# EAGLE board Logic_board (EAGLE 7.6.0)
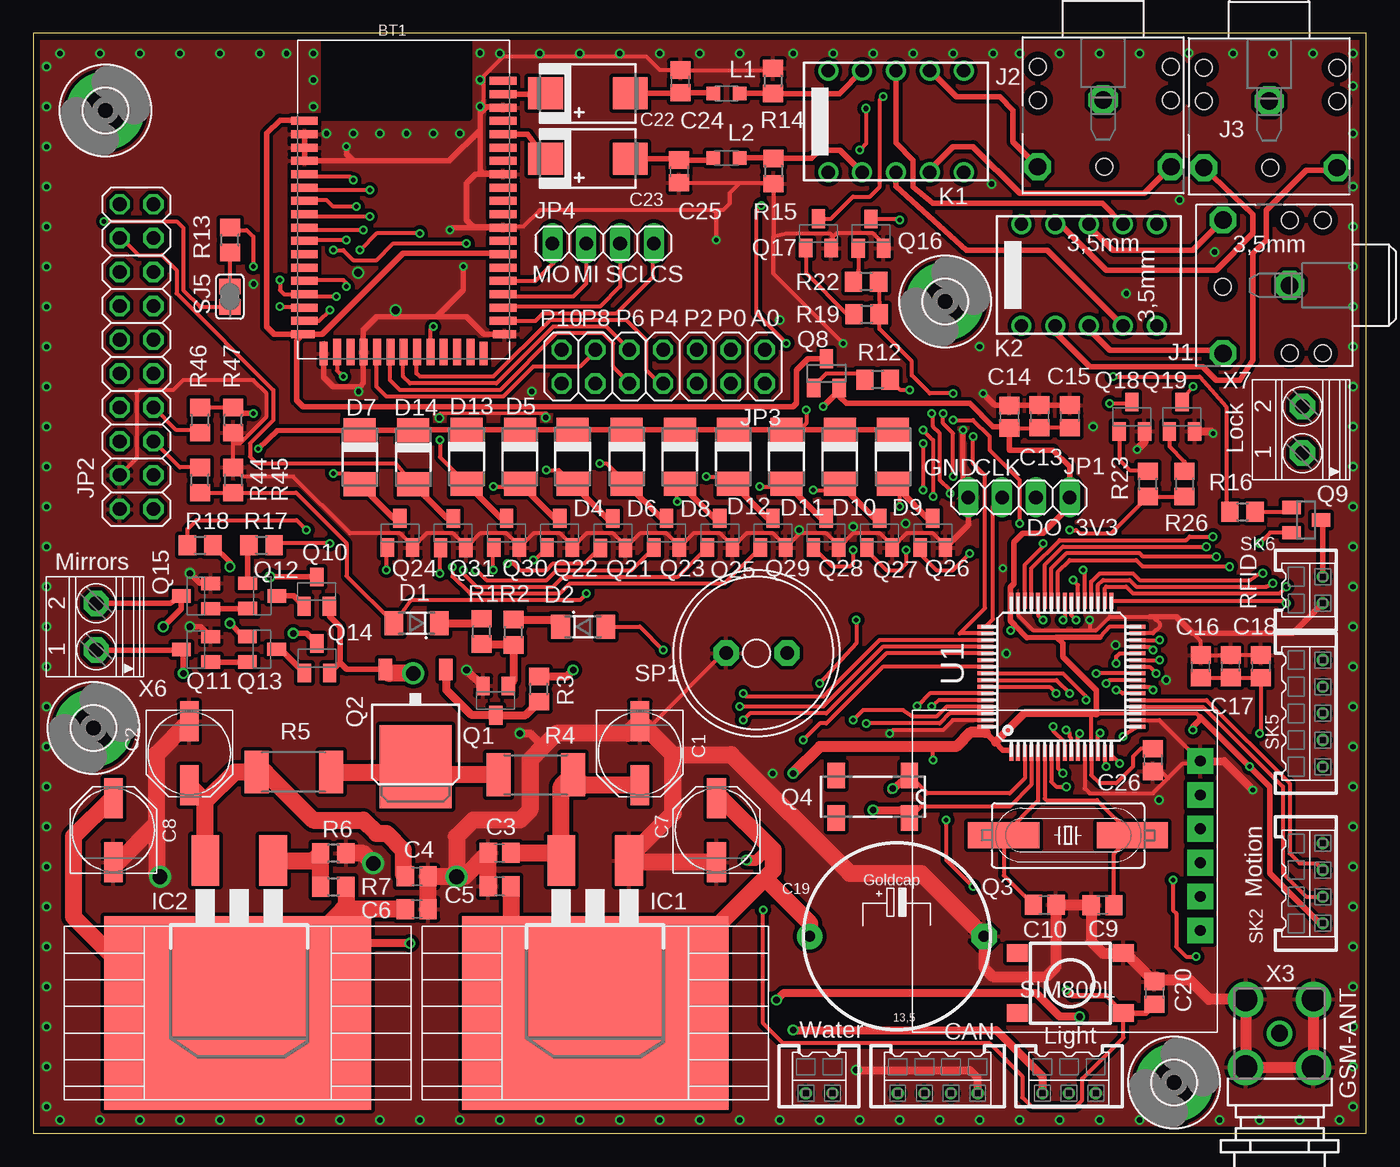
[diagram p1: board, top side]
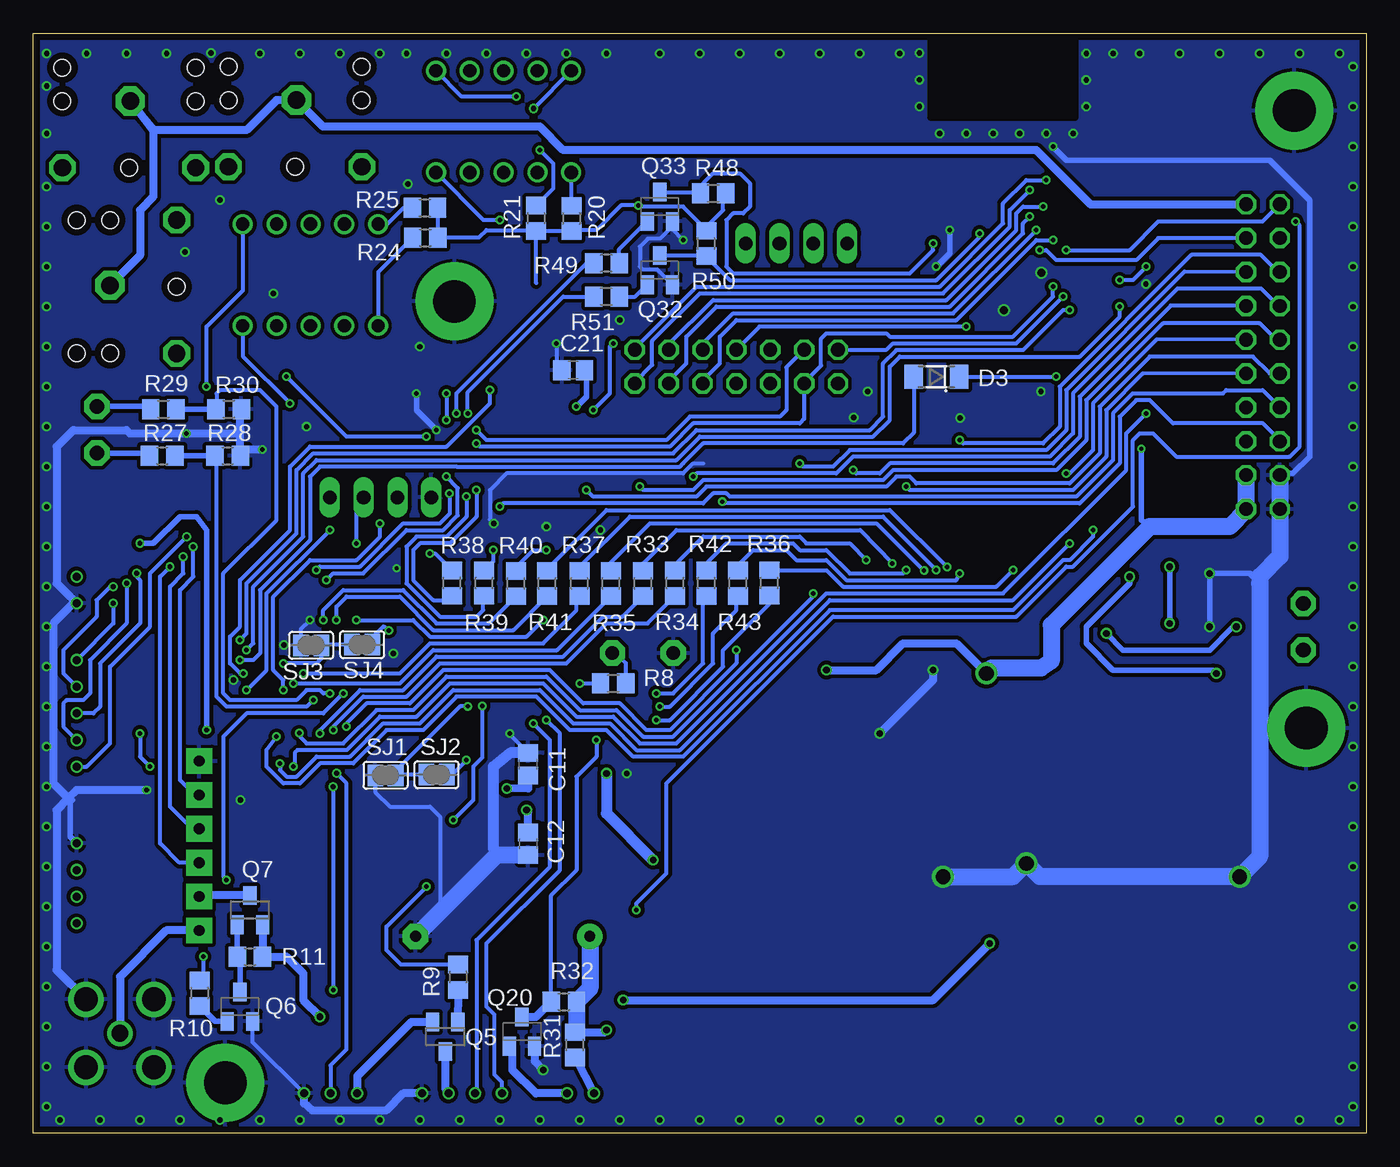
[diagram p2: board, bottom side, seen from below]

Size 100 x 82.5 mm. Coordinates in mm from the lower left corner, seen from the top.
Outline: 0,0 100,0 100,82.5 0,82.5 0,0
Copper layers (1*16): Top 0.035mm / dielectric 1.6mm / Bottom 0.035mm
Design rules "Elecrow_2-layer_PCB_eagle_rule": minimum track width 6mil, minimum drill 12mil, track to track 6mil, track to pad 6mil, pad to pad 6mil, via to via 8mil, smd to smd 0mil, copper to edge 20mil, drill to drill 10mil, minimum pad ring 6mil, minimum via ring 6mil, stop-mask expansion 0mil, vias tented up to drill 100mil, thermal gap 10mil

## Footprints (pad centres in the part's own frame; a part is rotated, then mirrored left to right if it is on the bottom)
WT32I = smd 2 x 0.6: 1 0.5,17.83; 2 0.5,16.83; 3 0.5,15.83; 4 0.5,14.83; 5 0.5,13.83; 6 0.5,12.83; 7 0.5,11.83; 8 0.5,10.83; 9 0.5,9.83; 10 0.5,8.83; 11 0.5,7.83; 12 0.5,6.83; 13 0.5,5.83; 14 0.5,4.83; 15 0.5,3.83; 16 0.5,2.83; 32 15.4,2.83; 33 15.4,3.83; 34 15.4,4.83; 35 15.4,5.83; 36 15.4,6.83; 37 15.4,7.83; 38 15.4,8.83; 39 15.4,9.83; 40 15.4,10.83; 41 15.4,11.83; 42 15.4,12.83; 43 15.4,13.83; 44 15.4,14.83; 45 15.4,15.83; 46 15.4,16.83; 47 15.4,17.83; 48 15.4,18.83; 49 15.4,19.83; 50 15.4,20.83 | smd 1.75 x 0.6: 17 0.38,1.83; 31 15.52,1.83 | smd 0.6 x 1.75: 18 1.95,0.38; 30 13.95,0.38 | smd 0.6 x 2: 19 2.95,0.5; 20 3.95,0.5; 21 4.95,0.5; 22 5.95,0.5; 23 6.95,0.5; 24 7.95,0.5; 25 8.95,0.5; 26 9.95,0.5; 27 10.95,0.5; 28 11.95,0.5; 29 12.95,0.5
PANASONIC_D = smd 3 x 1.4: + 2.4,0; - -2.4,0
C2012 = smd 1.3 x 1.5: 1 -0.85,0; 2 0.85,0
PAC-G-1 = drill 0.813 pad 1.93: + -6.54,0 | drill 0.813 pad 1.93 octagon: - 6.54,0
7343/T = smd 2.6 x 2.4: + 3.175,0; - -3.175,0
SOD80_DO213AA_MINIMELF = smd 1.4 x 1.8: A 1.7,0; C -1.7,0
DO-214AC = smd 1.8 x 2.4: A 2.025,0; C -2.025,0
D2PACK_HEATSINK = smd 20 x 14.5: 1 0,0
D2PACK = smd 2.083 x 3.81: 1 -2.54,-8.89; 3 2.54,-8.89 | smd 11.43 x 8.89: 2 0,2.54
STX3100 = drill 1.3 pad 2.184 octagon: 1 4.5,-0.1 | drill 1.3 pad 2 octagon: 2 9.5,5; 3 9.5,-5 | hole 1.25: 9.5,0; 4.5,5; 4.5,-5; 2,-5; 2,5
1X04 = drill 1.016 long: 1 -3.81,0; 2 -1.27,0; 3 1.27,0; 4 3.81,0
2X10 = drill 1.016 octagon: 1 -11.43,-1.27; 2 -11.43,1.27; 3 -8.89,-1.27; 4 -8.89,1.27; 5 -6.35,-1.27; 6 -6.35,1.27; 7 -3.81,-1.27; 8 -3.81,1.27; 9 -1.27,-1.27; 10 -1.27,1.27; 11 1.27,-1.27; 12 1.27,1.27; 13 3.81,-1.27; 14 3.81,1.27; 15 6.35,-1.27; 16 6.35,1.27; 17 8.89,-1.27; 18 8.89,1.27; 19 11.43,-1.27; 20 11.43,1.27
2X07 = drill 1.016 octagon: 1 -7.62,-1.27; 2 -7.62,1.27; 3 -5.08,-1.27; 4 -5.08,1.27; 5 -2.54,-1.27; 6 -2.54,1.27; 7 0,-1.27; 8 0,1.27; 9 2.54,-1.27; 10 2.54,1.27; 11 5.08,-1.27; 12 5.08,1.27; 13 7.62,-1.27; 14 7.62,1.27
TF2 = drill 1: 1 -5.08,-3.81; 2 -2.54,-3.81; 3 0,-3.81; 4 2.54,-3.81; 5 5.08,-3.81; 6 5.08,3.81; 7 2.54,3.81; 8 0,3.81; 9 -2.54,3.81; 10 -5.08,3.81
L2012C = smd 1 x 1: 1 -1,0; 2 1,0
SOT23-BEC = smd 1 x 1.4: B -0.95,-1.1; C 0,1.1; E 0.95,-1.1
D-PAK_TO252AA = smd 1 x 1.6: 1 -2.28,-4.8; 3 2.28,-4.8 | smd 5.4 x 6.2: 4 0,2.5
HC49UP = smd 5.334 x 1.93: 1 -4.826,0; 2 4.826,0
MC-306 = smd 1.3 x 1.9: 1 -2.75,-1.6; 2 2.75,-1.6; 3 2.75,1.6; 4 -2.75,1.6
SOT23 = smd 1 x 1.4: 1 -0.95,-1.1; 2 0.95,-1.1; 3 0,1.1
R0805 = smd 1.3 x 1.5: 1 -0.95,0; 2 0.95,0
R2512 = smd 1.8 x 3.2: 1 -2.8,0; 2 2.8,0
TACTILE_SWITCH_TALL = smd 1.55 x 1.3: A1 -3.975,-2.25; A2 3.975,-2.25; B1 -3.975,2.25; B2 3.975,2.25
SJ = smd 1.168 x 1.6: 1 -0.762,0; 2 0.762,0
DF3S-04 = drill 0.6: 1 -3,-1; 2 -1,-1; 3 1,-1; 4 3,-1
DF3S-03 = drill 0.6: 1 -2,-1; 2 0,-1; 3 2,-1
DF3S-02 = drill 0.6: 1 -1,-1; 2 1,-1
DF3S-05 = drill 0.6: 1 -4,-1; 2 -2,-1; 3 0,-1; 4 2,-1; 5 4,-1
AL11P = drill 1.016 pad 1.905 octagon: + 2.286,0; - -2.286,0
TQFP64 = smd 1.2 x 0.3: 1 -5.7,3.75; 2 -5.7,3.25; 3 -5.7,2.75; 4 -5.7,2.25; 5 -5.7,1.75; 6 -5.7,1.25; 7 -5.7,0.75; 8 -5.7,0.25; 9 -5.7,-0.25; 10 -5.7,-0.75; 11 -5.7,-1.25; 12 -5.7,-1.75; 13 -5.7,-2.25; 14 -5.7,-2.75; 15 -5.7,-3.25; 16 -5.7,-3.75; 33 5.7,-3.75; 34 5.7,-3.25; 35 5.7,-2.75; 36 5.7,-2.25; 37 5.7,-1.75; 38 5.7,-1.25; 39 5.7,-0.75; 40 5.7,-0.25; 41 5.7,0.25; 42 5.7,0.75; 43 5.7,1.25; 44 5.7,1.75; 45 5.7,2.25; 46 5.7,2.75; 47 5.7,3.25; 48 5.7,3.75 | smd 0.3 x 1.2: 17 -3.75,-5.7; 18 -3.25,-5.7; 19 -2.75,-5.7; 20 -2.25,-5.7; 21 -1.75,-5.7; 22 -1.25,-5.7; 23 -0.75,-5.7; 24 -0.25,-5.7; 25 0.25,-5.7; 26 0.75,-5.7; 27 1.25,-5.7; 28 1.75,-5.7; 29 2.25,-5.7; 30 2.75,-5.7; 31 3.25,-5.7; 32 3.75,-5.7; 49 3.75,5.7; 50 3.25,5.7; 51 2.75,5.7; 52 2.25,5.7; 53 1.75,5.7; 54 1.25,5.7; 55 0.75,5.7; 56 0.25,5.7; 57 -0.25,5.7; 58 -0.75,5.7; 59 -1.25,5.7; 60 -1.75,5.7; 61 -2.25,5.7; 62 -2.75,5.7; 63 -3.25,5.7; 64 -3.75,5.7
SIM-CORE = drill 0.8 pad 1.93 square: GND 1.27,3.81; NET 1.27,16.51; RST 1.27,11.43; RXD 1.27,8.89; TXD 1.27,6.35; VCC 1.27,13.97
3,2-PAD = drill 3.2 pad 5.842: B3,2 0,0
BU-SMA-G = drill 1.27: 1 0,0 | drill 1.778: 2 -2.55,2.55; 3 2.55,2.55; 4 2.55,-2.55; 5 -2.55,-2.55
1751248 = drill 1.1 pad 1.905 octagon: 1 -1.75,-0.1; 2 1.75,-0.1

## Placement (x,y rotation side)
BT1  WT32I  [WT32I]  19.84,58.1 0 top
C1  220uF  [PANASONIC_D]  45.5,28.5 270 top
C2  220uF  [PANASONIC_D]  11.7,28.5 270 top
C3  100n  [C2012]  34.98,21.03 180 top
C4  100n  [C2012]  28.77,19.27 0 top
C5  100n  [C2012]  34.98,18.53 180 top
C6  100n  [C2012]  28.77,16.82 0 top
C7  220uF  [PANASONIC_D]  51.25,22.75 90 top
C8  220uF  [PANASONIC_D]  6,22.75 90 top
C9  10pF  [C2012]  80.22,17.12 0 top
C10  10pF  [C2012]  75.88,17.13 180 top
C11  6,8pF  [C2012]  62.88,27.68 270 bottom
C12  6,8pF  [C2012]  62.87,21.72 90 bottom
C13  100nF  [C2012]  75.5,53.76 270 top
C14  100nF  [C2012]  73.23,53.74 270 top
C15  100nF  [C2012]  77.77,53.77 270 top
C16  100nF  [C2012]  87.58,35.01 270 top
C17  100nF  [C2012]  89.83,35.03 270 top
C18  100nF  [C2012]  92.11,35.02 270 top
C19  [PAC-G-1]  64.79,14.77 0 top
C20  100nF  [C2012]  84.12,10.53 270 top
C21  2u2  [C2012]  59.5,57.25 180 bottom
C22  330u/6V3  [7343/T]  41.6,78 180 top
C23  330u/6V3  [7343/T]  41.6,73.1 180 top
C24  33p  [C2012]  48.55,78.89 270 top
C25  33p  [C2012]  48.45,72.14 270 top
C26  100nF  [C2012]  84,28 90 top
D1  LL4148  [SOD80_DO213AA_MINIMELF]  28.75,38.25 180 top
D2  LL4148  [SOD80_DO213AA_MINIMELF]  41.25,38 0 top
D3  LL4148  [SOD80_DO213AA_MINIMELF]  32.25,56.75 180 bottom
D4  [DO-214AC]  40.45,50.76 270 top
D5  [DO-214AC]  36.5,50.75 270 top
D6  [DO-214AC]  44.52,50.76 270 top
D7  [DO-214AC]  24.5,50.71 270 top
D8  [DO-214AC]  48.5,50.75 270 top
D9  [DO-214AC]  64.5,50.75 270 top
D10  [DO-214AC]  60.5,50.75 270 top
D11  [DO-214AC]  56.5,50.75 270 top
D12  [DO-214AC]  52.5,50.75 270 top
D13  [DO-214AC]  32.5,50.75 270 top
D14  [DO-214AC]  28.5,50.71 270 top
H1  D2_HEAT  [D2PACK_HEATSINK]  42.17,9.02 0 top
H2  D2_HEAT  [D2PACK_HEATSINK]  15.33,9.02 0 top
IC1  3V3  [D2PACK]  42.15,11.57 180 top
IC2  4V2  [D2PACK]  15.45,11.57 180 top
J1  JACK_3.5  [STX3100]  98.75,63.5 180 top
J2  JACK_3.5  [STX3100]  80.36,82 270 top
J3  JACK_3.5  [STX3100]  92.82,81.92 270 top
JP1  [1X04]  73.95,47.7 180 top
JP2  [2X10]  7.75,58.25 90 top
JP3  [2X07]  47.25,57.5 180 top
JP4  [1X04]  42.75,66.75 0 top
K1  TF2-L2-9V  [TF2]  64.72,75.88 0 top
K2  TF2-L2-9V  [TF2]  79.21,64.38 0 top
L1  33n  [L2012C]  52,78 0 top
L2  33n  [L2012C]  52.01,73.15 0 top
Q1  BC817-40LT1SMD  [SOT23-BEC]  34.69,32.46 180 top
Q2  IRFR5305  [D-PAK_TO252AA]  28.68,30 180 top
Q3  8MHz  [HC49UP]  77.63,22.35 180 top
Q4  MC-306 - 32,768kHz  [MC-306]  62.98,25.25 180 top
Q5  BSS84  [SOT23]  69.1,7.25 180 bottom
Q6  BC817-40LT1SMD  [SOT23-BEC]  84.5,9.5 0 bottom
Q7  BSS84  [SOT23]  83.75,16.75 0 bottom
Q8  BSS84  [SOT23]  59.5,57 0 top
Q9  BSS84  [SOT23]  95.5,46 270 top
Q10  BC807-40LT1SMD  [SOT23-BEC]  21.27,40.63 0 top
Q11  BC817-40LT1SMD  [SOT23-BEC]  12.21,36.29 90 top
Q12  BC817-40LT1SMD  [SOT23-BEC]  17.18,40.3 270 top
Q13  BC817-40LT1SMD  [SOT23-BEC]  17.16,36.31 270 top
Q14  BC807-40LT1SMD  [SOT23-BEC]  21.28,35.63 0 top
Q15  BC817-40LT1SMD  [SOT23-BEC]  12.21,40.3 90 top
Q16  BC817-40LT1SMD  [SOT23-BEC]  62.84,67.48 0 top
Q17  BC817-40LT1SMD  [SOT23-BEC]  58.91,67.49 0 top
Q18  BC817-40LT1SMD  [SOT23-BEC]  82.42,53.74 0 top
Q19  BC817-40LT1SMD  [SOT23-BEC]  86.18,53.74 0 top
Q20  BC817-40LT1SMD  [SOT23-BEC]  63.34,7.63 0 bottom
Q21  BC817-40LT1SMD  [SOT23-BEC]  43.48,45.01 0 top
Q22  BC817-40LT1SMD  [SOT23-BEC]  39.49,45.03 0 top
Q23  BC817-40LT1SMD  [SOT23-BEC]  47.51,45.03 0 top
Q24  BC817-40LT1SMD  [SOT23-BEC]  27.5,45.04 0 top
Q25  BC817-40LT1SMD  [SOT23-BEC]  51.5,45.03 0 top
Q26  BC817-40LT1SMD  [SOT23-BEC]  67.48,45.03 0 top
Q27  BC817-40LT1SMD  [SOT23-BEC]  63.5,45.03 0 top
Q28  BC817-40LT1SMD  [SOT23-BEC]  59.48,45.03 0 top
Q29  BC817-40LT1SMD  [SOT23-BEC]  55.49,45.03 0 top
Q30  BC817-40LT1SMD  [SOT23-BEC]  35.51,45.03 0 top
Q31  BC817-40LT1SMD  [SOT23-BEC]  31.5,45.02 0 top
Q32  BC817-40LT1SMD  [SOT23-BEC]  53,64.75 0 bottom
Q33  BC817-40LT1SMD  [SOT23-BEC]  53,69.5 0 bottom
R1  2k2  [R0805]  33.63,37.64 90 top
R2  2k2  [R0805]  36.03,37.58 90 top
R3  100k  [R0805]  37.93,33.32 90 top
R4  F0.315  [R2512]  37.69,26.9 0 top
R5  F1.0  [R2512]  19.55,27.1 180 top
R6  1k2  [R0805]  22.5,21 180 top
R7  510  [R0805]  22.5,18.5 0 top
R8  220  [R0805]  56.5,33.75 0 bottom
R9  100  [R0805]  68.13,11.71 270 bottom
R10  2k2  [R0805]  87.53,10.51 270 bottom
R11  100k  [R0805]  83.75,13.25 0 bottom
R12  100  [R0805]  63.34,56.53 180 top
R13  100k  [R0805]  14.75,67 90 top
R14  1M  [R0805]  55.5,78.94 270 top
R15  1M  [R0805]  55.52,72.17 270 top
R16  100  [R0805]  90.72,46.62 0 top
R17  100k  [R0805]  17.12,44.12 0 top
R18  100k  [R0805]  12.52,44.12 0 top
R19  2k2  [R0805]  62.48,63.88 180 top
R20  120  [R0805]  59.63,68.62 270 bottom
R21  120  [R0805]  62.27,68.63 270 bottom
R22  2k2  [R0805]  62.51,61.45 0 top
R23  2k2  [R0805]  83.63,48.71 90 top
R24  120  [R0805]  70.6,67.17 0 bottom
R25  120  [R0805]  70.62,69.41 0 bottom
R26  2k2  [R0805]  86.37,48.71 270 top
R27  6k8  [R0805]  90.33,50.82 0 bottom
R28  1k8  [R0805]  85.42,50.82 0 bottom
R29  6k8  [R0805]  90.25,54.32 0 bottom
R30  1k8  [R0805]  85.34,54.32 0 bottom
R31  510  [R0805]  59.37,6.63 90 bottom
R32  240  [R0805]  60.2,9.87 0 bottom
R33  2k2  [R0805]  54.27,41.24 90 bottom
R34  2k2  [R0805]  51.85,41.26 90 bottom
R35  2k2  [R0805]  56.67,41.25 90 bottom
R36  2k2  [R0805]  44.78,41.28 90 bottom
R37  2k2  [R0805]  59.02,41.25 90 bottom
R38  2k2  [R0805]  68.59,41.27 90 bottom
R39  2k2  [R0805]  66.18,41.26 90 bottom
R40  2k2  [R0805]  63.78,41.23 90 bottom
R41  2k2  [R0805]  61.44,41.24 90 bottom
R42  2k2  [R0805]  49.5,41.26 90 bottom
R43  2k2  [R0805]  47.14,41.26 90 bottom
R44  6k8  [R0805]  12.5,49 90 top
R45  1k8  [R0805]  15,49 270 top
R46  6k8  [R0805]  12.5,53.5 270 top
R47  1k8  [R0805]  15,53.5 90 top
R48  100k  [R0805]  49,70.5 0 bottom
R49  2k2  [R0805]  57,65.25 180 bottom
R50  100k  [R0805]  49.5,66.75 90 bottom
R51  2k2  [R0805]  57,62.75 180 bottom
S1  SWITCH-MOMENTARY-2SMD-4  [TACTILE_SWITCH_TALL]  77.81,11.27 0 top
SJ1  [SJ]  73.58,26.85 180 bottom
SJ2  [SJ]  69.75,26.9 0 bottom
SJ3  [SJ]  79.16,36.6 180 bottom
SJ4  [SJ]  75.33,36.65 0 bottom
SJ5  [SJ]  14.75,62.75 90 top
SK1  [DF3S-04]  67.85,4 0 top
SK2  [DF3S-04]  95.75,18.75 90 top
SK3  [DF3S-03]  77.7,4 0 top
SK4  [DF3S-02]  58.95,4 0 top
SK5  [DF3S-05]  95.75,31.5 90 top
SK6  [DF3S-02]  95.75,40.75 90 top
SP1  AL11P  [AL11P]  54.26,36.02 0 top
U1  STM32F10XRXT6  [TQFP64]  77.13,34.24 90 top
U2  SIM800L  [SIM-CORE]  88.83,31.73 180 top
U$1  SCREW_3.2  [3,2-PAD]  85.6,3.8 0 top
U$2  SCREW_3.2  [3,2-PAD]  68.4,62.4 0 top
U$3  SCREW_3.2  [3,2-PAD]  4.5,30.4 0 top
U$4  SCREW_3.2  [3,2-PAD]  5.4,76.7 0 top
X3  BU-SMA-G  [BU-SMA-G]  93.5,7.5 270 top
X6  1751248  [1751248]  4.62,38 90 top
X7  1751248  [1751248]  95.12,52.77 90 top

## Tracks (layer width: path | path; a pad name or v marks a point on that pad's centre or on a via)
4V2
  Bottom 0.406: 87.47,17.85 U2.VCC
  Bottom 0.61: Q7.3 87.47,17.85
12_IN  (via drill 0.33 pad 0.41)
  Top 0.305: R44.1 R45.2 19.7,48.05 23.5,44.25 23.5,41.8 D1.A 28.3,40 41,40 v41.5,40.5 | U1.14 79.88,29.88 v80.05,30.02
  Bottom 0.305: v41.5,40.5 41.5,40.25 52,29.75 54.25,29.75 56.25,31.75 59,31.75 61.5,34.25 69,34.25 71.5,31.75 74.25,31.75 76.75,29.25 79.5,29.25 80,29.75 v80.05,30.02
12_VOL  (via drill 0.33 pad 0.41)
  Top 0.305: R46.1 R47.2 | U1.15 80.38,27.62 v80.5,27.5
  Top 0.406: R47.2 15.05,54.45 15.5,54 v16.5,54
  Bottom 0.305: v80.5,27.5 80.38,27.62 U1.15 80.17,28.75 76.5,28.75 74,31.25 71.25,31.25 68.75,33.75 61.75,33.75 59.25,31.25 56.5,31.25 54.5,29.25 51.75,29.25 40.5,40.5 27.25,40.5 18,49.75 18,52.5 v16.5,54
+3V3  (via drill 0.33 pad 0.38, 0.33 pad 0.41, 0.37 pad 0.41, 0.5 pad 0.61, 0.5 pad 0.81)
  Top 0.305: U1.1 73.38,28.62 73.25,28.75 | U1.64 71.43,30.07 71.5,30 | 87.5,31.25 87.26,31.49 U1.19 79.75,31.5 79.38,31.37 U1.13 79.38,26.87 80,26.25 81.25,26.25 82.5,27.5 82.5,28.25 83.1,28.85 C26.2 | Q9.2 92.8,45.05 v92,44.25 | U1.32 80.74,37.99 80,37.23 | v67.5,28 67.5,29 | v73.33,37.71 73.25,37.75 73.62,38.12 | C16.2 89.81,34.16 C17.2 C18.2 92.11,30.11 v92,30 | C14.2 75.48,52.89 C13.2 C15.2 | U1.48 73.38,39.06 73.32,39
  Top 0.406: 73.25,28.75 72.75,28.75 72.17,29.32 71.5,30 | SK2.1 96.5,15.75 92.75,19.5 92.75,26 v91.25,27.5 87.62,31.12 | 87.62,31.12 87.5,31.25 | v87,30.25 87,30.5 87.62,31.12 | 79.75,31.5 79.75,33.25 77.25,35.75 77.25,36.75 76.75,37.2 | v59.25,54.5 60.45,55.7 Q8.2 60.45,55.3 61,54.75 70.25,54.75 72,53 73.13,53 C14.2 73.23,51.27 73.25,51.25 76.5,51.25 77.75,50 JP1.1 77.25,47.19 77.25,46.5 75.75,45 74.25,45 73.57,44.32 73.57,41.21 73.32,40.96 73.32,39 73.32,38.45 73.62,38.12 74.55,37.17 76.75,37.2 | 80,37.23 76.75,37.2
  Top 0.61: v57,7.75 72.25,7.75 75.7,4.3 SK3.1 | 79.75,31.5 74.35,31.5 72.17,29.32
  Top 0.813: 71.43,30.07 70.32,30.07 69.25,29 67.5,29 59,29 v57,27 | v53.5,20.5 54.25,20.5 55.25,21.5
  Top 1.27: H1.1 35.83,15.36 C5.1 35.83,15.35 41.72,9.46 | 41.72,9.46 IC1.2 | C7.+ 51.6,25.15 55.25,21.5 55.5,21.25 55.5,19.75 54.88,19.12 | 54.88,19.12 50.5,14.75 47,14.75 41.72,9.46 | C19.+ 58.25,15.75 54.88,19.12
  Bottom 0.305: SJ2.2 68.6,26.9 v67.5,28 | SJ4.2 74.57,37.18 73.75,38 73.63,37.99 v73.33,37.71 | v92,30 92,28.25 v91.25,27.5
  Bottom 0.406: v92,44.25 91,44.25 89,46.25 87.75,46.25 87,45.25 v87,30.25 | v59.25,54.5 58.5,55.25 58.5,57.1 C21.1
  Bottom 0.61: Q5.2 71.65,8.35 75.7,4.3 SK3.1 | R31.2 57.17,7.58 v57,7.75
  Bottom 0.813: v57,27 57,24 v53.5,20.5
  Bottom 1.27: C19.+ 58.25,10.87 R32.2 59.25,7.7 R31.2
+12V  (via drill 0.3 pad 0.38, 0.33 pad 0.25, 0.33 pad 0.38, 0.5 pad 0.61, 1.1 pad 1.27)
  Top 0.305: v58,54.25 58,53.27 57.5,52.77 | v56.5,59.25 54.25,61.5 54.25,69.25 v54.6,69.6
  Top 0.406: Q10.E 22.22,38.78 23,38 23,35.3 | 23,35.3 Q14.E | Q2.3 23.5,34.8 23,35.3 | D9.C D10.C 57.5,52.77 D11.C D12.C D8.C D6.C D4.C 36.51,52.78 D5.C D13.C 28.55,52.77 D14.C D7.C 18.28,52.7 v16.88,51.34
  Top 0.61: R3.2 40.02,34.27 v40.5,34.75 | 26.7,34.5 Q2.3
  Top 1.27: v28.5,34.5 26.7,34.5
  Bottom 0.305: R21.2 R20.2 59.55,67.75 57.75,67.75 55.9,69.6 v54.6,69.6 54.5,69.5 51.25,69.5 49.75,68 49.5,68 | R21.2 62.34,67.75 66,67.75 66.58,67.17 R24.2 69.65,69.39 R25.2 | 62.27,63.77 R21.2 | R50.2 49.5,68 | 49.5,68 48.25,69.25 48.25,70.3 R48.2 | v58,54.25 56.75,55.5 56.75,59 v56.5,59.25
  Bottom 0.406: v16.88,51.34 16.88,46 16.25,45.5
  Bottom 0.61: v40.5,34.75 36.75,34.75 34.75,36.75 30.75,36.75 v28.5,34.5
  Bottom 1.27: JP2.3 JP2.1 9.02,46.73 10.25,45.5 16.25,45.5 23.62,38.12 23.62,35.42 24.4,34.9 28.1,34.9 v28.5,34.5
AD_REL1  (via drill 0.33 pad 0.41)
  Top 0.305: U1.52 63.74,36.49 59.25,32 v53,32
  Bottom 0.305: v53,32 52.25,32 49,35.25 49,37.5 47.25,39.25 47.25,40.2 R43.1
AD_REL1_B
  Top 0.305: JP2.18 6.6,67.16 7.9,65.86 9.64,65.86 10.75,64.75 10.75,63 18,55.75 18,53.5 16.25,51.75 16.25,50.75 16.75,50.25 27.18,50.25 D14.A
  Top 0.406: Q31.C 31.06,46.12 D14.A
AD_REL2  (via drill 0.33 pad 0.41)
  Top 0.305: U1.51 63.49,36.99 59.25,32.75 53.5,32.75 v53.25,33
  Bottom 0.305: v53.25,33 52,33 49.75,35.25 49.75,40.06 R42.1
AD_REL2_B  (via drill 0.33 pad 0.38)
  Top 0.305: v30.5,52 30.5,50.73 D13.A
  Top 0.406: Q30.C 35.09,46.13 D13.A
  Bottom 0.305: JP2.16 6.63,64.62 7.9,65.89 13.11,65.89 23,56 23,53 24.25,51.75 30.25,51.75 v30.5,52
AD_REL3  (via drill 0.33 pad 0.41)
  Top 0.305: U1.39 77.88,38.87 v78.25,38.5
  Bottom 0.305: v78.25,38.5 78.25,39.25 76.75,40.75 72.25,40.75 69.75,38.25 65.81,38.25 R40.1
AD_REL3_B  (via drill 0.33 pad 0.38)
  Top 0.305: v54.5,48.5 56.27,48.5 D11.A
  Top 0.406: Q28.C 59.09,46.13 D11.A
  Bottom 0.305: JP2.12 6.79,59.54 8,60.75 15.25,60.75 21,55 21,52 23.25,49.75 35.5,49.75 36.25,49 49.75,49 50.5,48.25 54.25,48.25 v54.5,48.5
AD_REL4  (via drill 0.33 pad 0.41)
  Top 0.305: U1.25 80.01,34.49 v79.75,34.5
  Bottom 0.305: v79.75,34.5 72.5,34.5 70.25,36.75 61.75,36.75 59.25,39.25 59.25,40.07 R37.1
AD_REL4_B  (via drill 0.3 pad 0.3)
  Top 0.305: v48.31,47.38 48.31,48.54 D8.A
  Top 0.406: Q25.C 51.09,46.13 D8.A
  Bottom 0.305: JP2.6 6.48,51.98 7.75,53.25 14.5,53.25 16.25,55 17.25,55 18.5,53.75 18.5,50.25 21.5,47.25 48.16,47.25 v48.31,47.38
AD_REL5_B  (via drill 0.33 pad 0.38)
  Top 0.305: v58.5,48.25 60.02,48.25 D10.A
  Top 0.406: Q27.C 63.09,46.13 D10.A
  Bottom 0.305: JP2.10 7.25,57 8.5,58.25 16.25,58.25 20,54.5 20,51 22.25,48.75 33.75,48.75 34.25,49.25 35.25,49.25 36,48.5 49.5,48.5 50.25,47.75 58,47.75 v58.5,48.25
AD_REL6_B  (via drill 0.33 pad 0.38)
  Top 0.305: v65,47 65,48 65.11,48.11
  Top 0.406: Q26.C 67.09,46.13 65.11,48.11 D9.A
  Bottom 0.305: v65,47 64.75,47.25 49.75,47.25 49,48 48,48 47.75,47.75 21.75,47.75 19,50.5 19,54 17.5,55.5 10.75,55.5 10.5,55.75 7.77,55.75 JP2.8
AGND
  Bottom 0.61: J1.1 92,65.85 92,69.25 91,70.25 91,75.25 92.7,77.45 J3.1 90.94,75.25 84,75.25 81.75,77.5 J2.1 78.26,75.5 62,75.5 60.25,73.75 24.75,73.75 20.68,69.68 JP2.19
AUDIO1  (via drill 0.33 pad 0.38)
  Top 0.305: U1.22 81.74,32.99 v81.25,33.25 | R22.2 63.46,61.56 | R19.1 63.43,63.43 R22.2 | R22.2 63.46,60.34 65.9,57.9 65.9,56.85 67.25,55.5 v69,55.5 | v74,45.75 74,49 71.75,51.25 71.75,52.25 70.5,53.5 v69,53.5
  Bottom 0.305: v81.25,33.25 81.25,34 82,34.75 82,40.25 79.25,43 75.75,43 74,44.75 v74,45.75 | v69,55.5 v69,53.5
AUDIO2  (via drill 0.33 pad 0.38)
  Top 0.305: U1.23 83.76,33.49 v84,33.25 | v77.75,45.25 78.25,45.25 78.5,45 80.87,45 R23.1 R26.2
  Bottom 0.305: v84,33.25 82.5,34.75 82.5,40.5 v77.75,45.25
BOOT0  (via drill 0.33 pad 0.41)
  Top 0.305: U1.60 67.97,32.49 v67.39,32.03
  Bottom 0.305: v67.39,32.03 67.97,32.03 72.82,27.18 SJ1.1 72.77,26.9 SJ2.1
BOOT1  (via drill 0.33 pad 0.41)
  Top 0.305: v81.25,35.25 81.25,35.75 81.5,36 U1.28
  Bottom 0.305: SJ4.1 78.35,36.65 SJ3.1 78.4,35.6 78.75,35.25 v81.25,35.25
BT_A0  (via drill 0.33 pad 0.38)
  Top 0.305: v24,71.5 23.75,71.75 20.52,71.75 BT1.5
  Bottom 0.305: JP3.1 54.87,58.88 50.25,63.5 32,63.5 27.25,68.25 27.25,69.75 25.5,71.5 v24,71.5
BT_A1  (via drill 0.33 pad 0.38)
  Top 0.305: v25.25,70.75 20.52,70.75 BT1.6
  Bottom 0.305: JP3.2 54.87,56.33 53.57,57.63 53.57,59.43 50,63 31.75,63 26.75,68 26.75,69.25 v25.25,70.75
BT_LEFT
  Top 0.406: L1.2 55.48,78 R14.2 60.48,77.99 K1.9
BT_P0  (via drill 0.33 pad 0.38)
  Top 0.305: v24.25,69.5 22.5,69.5 22,70 20.41,70 BT1.7
  Bottom 0.305: JP3.3 52.33,59.17 49,62.5 31.5,62.5 26.25,67.75 26.25,69 25.75,69.5 v24.25,69.5
BT_P1  (via drill 0.33 pad 0.38)
  Top 0.305: v25.25,68.75 20.52,68.75 BT1.8
  Bottom 0.305: JP3.4 52.33,56.42 51,57.75 51,59.75 48.75,62 31.25,62 25.75,67.5 25.75,68.25 v25.25,68.75
BT_P2  (via drill 0.33 pad 0.38)
  Top 0.305: v24.75,67.75 20.52,67.75 BT1.9
  Bottom 0.305: JP3.5 49.79,59.21 47.5,61.5 31,61.5 v24.75,67.75
BT_P3  (via drill 0.33 pad 0.38)
  Top 0.305: v23.5,67 20.41,67 BT1.10
  Bottom 0.305: JP3.6 49.79,56.46 48.5,57.75 48.5,59.75 47.25,61 30.75,61 24.75,67 v23.5,67
BT_P4  (via drill 0.33 pad 0.38)
  Top 0.305: BT1.26 29.79,60.29 v30,60.5
  Bottom 0.305: v30,60.5 45.52,60.5 JP3.7
BT_P5
  Top 0.305: JP3.8 47.02,56.23 46,57.25 46,59.5 44.5,61 38.75,61 34.5,56.75 29,56.75 28.75,57 28.75,58.56 BT1.25
BT_P6
  Top 0.305: JP3.9 44.71,58.79 43,60.5 39,60.5 34.75,56.25 28.25,56.25 27.75,56.75 27.75,58.56 BT1.24
BT_P7
  Top 0.305: JP3.10 44.71,56.29 43.5,57.5 43.5,59.25 42.75,60 39.25,60 35,55.75 27.5,55.75 26.75,56.5 26.75,58.56 BT1.23
BT_P8  (via drill 0.33 pad 0.38)
  Top 0.305: JP3.11 42.17,58.67 41,57.5 37.5,57.5 35.25,55.25 26.5,55.25 25.75,56 25.75,58.56 BT1.22 | v66.75,52.75 67.5,52 v67.5,47.75
  Bottom 0.305: v66.75,52.75 66,52 52.5,52 50.75,53.75 44,53.75 43.5,54.25 43.5,57.44 JP3.11 | v67.5,47.75 67.5,46.25 69,44.75 71.25,44.75 72,44 72,41.25 69.5,38.75 66.75,38.75 66.25,39.25 66.25,40.24 R39.1
BT_P9  (via drill 0.33 pad 0.38)
  Top 0.305: v23.5,63.5 23.5,63.75 23.25,64 20.41,64 BT1.13 | v66.75,51.75 v66.75,48.25
  Bottom 0.305: v23.5,63.5 23.5,62.75 26.5,59.75 35.75,59.75 36,60 40.5,60 40.89,59.61 40.89,57.58 42.17,56.31 JP3.12 42.17,53.58 42.5,53.25 50.5,53.25 52.25,51.5 66.5,51.5 v66.75,51.75 | v66.75,48.25 66.75,46.25 68.75,44.25 71,44.25 71.5,43.75 71.5,41.5 70,40 68.91,40 R38.1
BT_P10  (via drill 0.33 pad 0.38)
  Top 0.305: v22.75,62.75 20.52,62.75 BT1.14 18.82,62.93 18.5,63.25 v18.5,64 | R13.2 14.95,67.75 16,67.75 16.5,67.25 v16.5,65
  Bottom 0.305: JP3.13 35.98,58.77 35.5,59.25 26.25,59.25 v22.75,62.75 | v16.5,65 17.5,64 v18.5,64
BT_POW  (via drill 0.33 pad 0.38)
  Top 0.305: U1.26 83.76,34.99 v84.25,34.5 | v65.75,55.75 65.07,55.75 R12.1
  Bottom 0.305: v84.25,34.5 84.5,34.5 85.25,35.25 85.25,37.25 84.5,38 84.5,41.5 80.75,45.25 80.75,50 79.25,51.5 69,51.5 65.75,54.75 v65.75,55.75
BT_RES  (via drill 0.33 pad 0.38)
  Top 0.305: U1.27 v84.49,35.49 v84.5,35.5
  Bottom 0.305: D3.A 33.95,52.55 34.75,51.75 49.75,51.75 51.25,50.25 51.5,50 68.25,50 78.5,50 79.25,49.25 79.25,44.5 83,40.75 83,36 83.5,35.5 v84.5,35.5
BT_RIGHT
  Top 0.406: L2.2 55.49,73.15 R15.1 58.37,73.12 59,73.75 60.5,73.75 K1.2
BT_RX  (via drill 0.33 pad 0.38)
  Top 0.305: U1.29 83.76,36.49 v84,36.25 | v18.5,62 20.27,62 BT1.15
  Bottom 0.305: v84,36.25 83.5,36.75 83.5,41 79.75,44.75 79.75,49.5 78.75,50.5 51.75,50.5 50,52.25 37,52.25 35.75,53.5 35.75,57.5 35,58.25 21.5,58.25 18.5,61.25 v18.5,62
BT_TX  (via drill 0.33 pad 0.38)
  Top 0.305: U1.30 v84.49,36.99 v84.5,37 | BT1.16 21.43,60.93 v22.25,61.75
  Bottom 0.305: v84.5,37 84,37.5 84,41.25 80.25,45 80.25,49.75 79,51 52,51 50.25,52.75 37.25,52.75 36.25,53.75 36.25,57.75 35.25,58.75 25.75,58.75 22.75,61.75 v22.25,61.75
BUZZER  (via drill 0.33 pad 0.41)
  Top 0.305: U1.44 75.38,38.87 v75.75,38.5 | v61.75,38.5 61.75,36.75 v59,33.75
  Bottom 0.305: v75.75,38.5 71.5,38.5 70.25,37.25 63,37.25 v61.75,38.5 | v59,33.75 R8.1
C_OSC1  (via drill 0.5 pad 0.61)
  Top 0.305: U1.3 74.38,26.63 73.25,25.5 67.08,25.5 Q4.1
  Top 0.61: v64.47,25.86 64.38,25.75 Q4.1
  Bottom 0.61: C11.2 62.88,25.87 v64.47,25.86
C_OSC2  (via drill 0.5 pad 0.61)
  Top 0.305: U1.4 74.88,26.13 73.25,24.5 66.58,24.5 Q4.4
  Top 0.61: v63,24.25 65.13,24.25 Q4.4
  Bottom 0.61: C12.2 62.87,24.12 v63,24.25
CAN_POW  (via drill 0.33 pad 0.38, 0.33 pad 0.41)
  Top 0.305: U1.59 67.26,32.99 v66.32,32.05 | v70.5,18.5 68.5,20.5 v68.5,23.5
  Bottom 0.305: v66.32,32.05 66.32,28.18 67,27.5 67,25 v68.5,23.5 | R9.1 72.41,12.66 73.5,13.75 73.5,15.5 v70.5,18.5
CAN_RX  (via drill 0.33 pad 0.41)
  Top 0.305: U1.61 68.49,31.99 67.75,31.25 66,31.25 65.25,31.75 62.25,31.75 v61.5,31
  Bottom 0.305: SK1.1 64.85,3.85 65.4,4.4 65.4,8.9 66,9.5 66,14.25 60.5,19.75 60.5,30 v61.5,31
CAN_TX  (via drill 0.33 pad 0.41)
  Top 0.305: U1.62 68.74,31.49 68,30.75 v62.5,30.75
  Bottom 0.305: v62.5,30.75 61.25,29.5 61.25,20 66.75,14.5 66.75,3.1 SK1.2
CHAR_POW  (via drill 0.33 pad 0.41)
  Top 0.305: U1.24 80.74,33.99 v80.5,33.75
  Bottom 0.305: v80.5,33.75 72.5,33.75 70,36.25 60.72,36.25 R35.1
CHAR_POW_B  (via drill 0.33 pad 0.38)
  Top 0.305: v42.5,50.25 43.01,50.25 D6.A
  Top 0.406: Q23.C 47.12,46.13 D6.A
  Bottom 0.305: JP2.15 13.63,64.62 22.5,55.75 22.5,52.75 24,51.25 38.75,51.25 40,50 42.25,50 v42.5,50.25
DAY_LIGHT  (via drill 0.33 pad 0.41)
  Top 0.305: U1.53 63.99,35.99 59.5,31.5 53.75,31.5 v53.25,31
  Bottom 0.305: v53.25,31 52.25,31 48.25,35 48.25,36.25 44.78,39.72 R36.1
DAY_LIGHT_B  (via drill 0.33 pad 0.38)
  Top 0.305: v22.5,49.5 23.68,49.5 D7.A
  Top 0.406: Q24.C 27.05,46.14 D7.A
  Bottom 0.305: JP2.11 15.71,59.54 20.5,54.75 20.5,51.25 22.25,49.5 v22.5,49.5
FAN  (via drill 0.33 pad 0.38)
  Top 0.305: U1.38 78.38,41.12 v78,41.5 | v69,49.25 69,52.5 68.25,53.25 v68.25,54
  Bottom 0.305: v78,41.5 77.5,42 75.25,42 72,45.25 69.25,45.25 68.15,46.35 68.15,48.4 v69,49.25 | v68.25,54 68.25,55.5 58.5,65.25 R49.2
FAN_B  (via drill 0.33 pad 0.38)
  Top 0.305: v22.5,66.25 23.25,66.25 24,65.5 25.75,65.5 27,66.75 v32.5,66.75
  Bottom 0.305: R48.1 50.05,70.6 Q33.C 50.4,70.6 49,72 47,72 46.25,71.25 46.25,69.5 46.75,69 47.5,69 48,68.5 48,65 47.5,64.5 34.25,64.5 32.5,66.25 v32.5,66.75 | v22.5,66.25 17.75,66.25 15.6,68.4 7.76,68.4 JP2.20
FUEL_POMP  (via drill 0.33 pad 0.41)
  Top 0.305: U1.10 77.88,29.62 77.75,29.75 77.75,30 v77.5,30.25
  Bottom 0.305: v77.5,30.25 77.5,30.5 75.25,32.75 72,32.75 69.5,35.25 60,35.25 57,38.25 53.91,38.25 R34.1
FUEL_POMP_B  (via drill 0.33 pad 0.38)
  Top 0.305: v34.5,48.5 36.27,48.5 D5.A
  Top 0.406: Q22.C 39.09,46.13 D5.A
  Bottom 0.305: JP2.9 16.75,57 19.5,54.25 19.5,50.75 22,48.25 34.25,48.25 v34.5,48.5
GAS_BUTTON  (via drill 0.33 pad 0.41)
  Top 0.305: U1.40 77.38,38.63 v77.25,38.5
  Bottom 0.305: v77.25,38.5 77.25,39.5 76.5,40.25 72.5,40.25 70,37.75 63.99,37.75 R41.1
GAS_BUTTON_B  (via drill 0.33 pad 0.38)
  Top 0.305: v50.5,49.25 51.98,49.25 D12.A
  Top 0.406: Q29.C 55.09,46.13 D12.A
  Bottom 0.305: JP2.14 6.61,62.08 7.87,63.35 14.15,63.35 22,55.5 22,52.5 23.75,50.75 38.5,50.75 39.75,49.5 50.25,49.5 v50.5,49.25
GND  (via drill 0.3 pad 0.13, 0.33 pad 0.38, 0.33 pad 0.41, 0.37 pad 0.41, 0.4 pad 0.2, 0.5 pad 0.61, 0.5 pad 0.81, 0.6, 1.1 pad 1.27)
  Top 0.254: 30.5,53.75 30.5,54 38.5,54 38.5,53.75
  Top 0.305: U1.18 84.49,30.99 U2.GND 87.39,27.75 86.25,27.75 85.12,26.62 | U1.12 78.88,25.87 79.25,25.5 84,25.5 85.12,26.62 | 15,51.75 R47.1 | 15,51.75 R45.1 15.7,49.25 19.5,49.25 23.75,45 27.5,45 28.45,44.05 Q24.E 29.52,45 31.5,45 32.45,44.05 Q31.E 33.53,45 35.5,45 36.46,44.04 Q30.E 37.53,45 39.5,45 40.44,44.06 Q22.E 41.51,45 43.5,45 44.43,44.07 Q21.E 45.52,45 47.5,45 48.45,44.05 Q23.E 49.52,45 51.5,45 52.45,44.05 Q25.E 53.52,45 55.5,45 56.44,44.06 Q29.E 57.51,45 59.5,45 60.43,44.07 Q28.E 61.5,45 63.5,45 64.45,44.05 Q27.E 65.52,45 67.5,45 68.43,44.07 Q26.E | JP2.4 7.75,50.65 7.75,55.5 8,55.75 10.5,55.75 11.25,56.5 16.5,56.5 17.5,55.5 17.5,53.75 15.5,51.75 15,51.75 | 51.97,28.78 52.35,28.4 | U1.47 73.88,38.87 75,37.75 79.25,37.75 | 79.25,37.75 79.75,37.75 80.75,38.75 83.75,38.75 84,38.75 84.5,38.25 84.5,38 84,37.5 U1.31 | SP1.- 51.97,36.22 46.08,30.32 | U1.63 68.99,30.99 68.25,30.25 64.5,30.25 v64.25,30 | v79.25,38.5 79.25,37.75 | R14.1 55.35,79.74 C24.1 47.01,79.74 46,80.75 35.25,80.75 33.75,79.25 33.75,77 33.88,76.88 | C25.2 53,71.29 | 53,71.29 55.45,71.29 R15.2 55.52,67.27 | 53,71.29 52.25,70.54 52.25,69.75 51.75,69.25 51,69.25 | Q16.E 63.8,66.7 63,67.5 60.25,67.5 60,67.25 | 60,67.25 60,67.28 Q17.E | v60.75,59.25 55.52,64.48 55.52,67.27 | 55.52,67.27 56.5,67.5 59.75,67.5 60,67.25 | 51,69.25 38,69.25 36.75,68 35.31,68 BT1.39 | C26.1 84.6,27.15 85.12,26.62 | 86.88,37.62 87.58,36.92 C16.1 89.81,35.86 C17.1 C18.1 | v51.25,67 51.25,69 51,69.25
  Top 0.406: SK6.1 94.49,37.49 87.01,37.49 86.88,37.62 85.75,38.75 83.75,38.75 | Q15.E 12.5,41.25 v11.75,42 | v11.75,38 12.55,38 Q11.E | Q26.E 70.14,45.64 JP1.4 69.75,48.09 v69.75,52.75 | BT1.31 33.82,59.93 32.5,61.25 30.25,61.25 | 30.25,61.25 25.75,61.25 24.75,60.25 24.75,58.64 BT1.21 24.75,58.56 24.75,56.25 24.5,56 22.5,56 21.79,56.71 BT1.18 | BT1.2 BT1.3 BT1.4 24,72.93 | 24,72.93 31.18,72.93 33.5,75.25 | 33.5,75.25 33.5,76.5 33.88,76.88 34,77 35.17,77 BT1.48 | 33.5,75.25 33.5,72.25 33.75,72 35.17,72 BT1.43 33.18,71.93 32.5,71.25 32.5,68.5 33,68 35.17,68 BT1.39 31.43,67.93 v31.25,67.75 | v32.25,65 32.25,63.25 30.25,61.25 | v23.5,74 23.5,73.43 24,72.93 | v71.25,55.5 72.16,54.59 C14.1 75.48,54.59 C13.1 C15.1
  Top 0.61: Q1.E 33.69,33.56 v32.5,34.75 | v36.5,30 37.25,30 38.25,29 | v61.75,4.75 70.25,4.75 70.85,4.15 SK1.4 | U2.GND 89.33,27.92 v91.5,25.75 | Q19.E 88.36,52.64 v88.5,52.5 | Q18.E 83.37,51.85 v82.8,51.28
  Top 0.813: C19.- 71.33,12.42 72,11.75 76,11.75 76.75,12.5 76.75,17.11 | C10.1 C9.1 | C9.1 79.37,14.38 80.25,13.5 81.77,13.5 | S1.B2 81.98,13.52 C20.1 | X3.2 X3.3 X3.4 X3.5 88.2,10.05 86.75,11.5 84.24,11.5
  Top 1.27: C8.- 6.35,20.35 9.25,23.25 | 9.25,23.25 9.25,28.45 C2.- | C5.2 C3.2 32.35,19.25 v31.75,19.25 | C7.- 44.8,20.35 IC1.1 44.69,20.69 48,24 48,28.4 | 48,28.4 46.08,30.32 C1.- 44.6,30 39.25,30 38.25,29 37.25,28 37.25,24.25 36.5,23.5 33,23.5 31.75,22.25 v31.75,19.25 | C6.2 C4.2 31.73,19.27 v31.75,19.25 | v25.5,20.25 24.75,21 R6.1 | 76.75,17.11 C10.1 | C9.1 | 81.77,13.5 S1.B2 | 84.24,11.5 C20.1 | 48,28.4 52.35,28.4 61.25,19.5 66.6,19.5 C19.- | 9.25,23.25 9.25,19.5 v9.5,19.25
  Bottom 0.305: v64.25,30 64.25,29.9 C11.1 | SK6.1 97,39.75 | 97.25,25 97.25,24.75 97,25 | SJ3.2 79.92,37.83 v79.25,38.5 | SJ1.2 74.34,25.59 73.25,24.5 70.25,24.5 69.5,23.75 69.5,16.6 C19.- | v60.75,59.25 60.75,57.65 C21.2 | SK3.3 83.55,6.85 Q6.E | Q32.E 53.2,64.8 54.3,64.8 54.5,65 54.5,66.5 53.9,67.1 53,67.1 52.05,68.05 Q33.E 52.05,67.8 v51.25,67 | 49.75,50.25 50.5,50.25 51.25,49.5 64.5,49.5 65.75,48.25 65.75,46.05 v65.45,45.75
  Bottom 0.406: 97.38,25.12 97.25,25 | 97.25,24.75 97.25,22.25 SK2.4 | v11.75,38 v11.75,42 8.75,42 8,41.25 | v31.25,67.75 31.25,66 v32.25,65 | v23.5,74 22.5,73 7.25,73 4.25,70 4.25,50.75 5.5,49.5 6.36,49.5 JP2.4 | v71.25,55.5 71.25,54.25 v69.75,52.75
  Bottom 0.61: v32.5,34.75 32.5,34 v36.5,30 | SK1.4 72.25,3 73.55,1.7 79.05,1.7 79.7,2.25 SK3.3 | Q20.E 62.39,5.39 v61.75,4.75 | 97,39.75 98.5,38.25 98.5,26.25 97.38,25.12 | v91.5,25.75 96.75,25.75 97.38,25.12 | X3.2 98.25,12.25 98.25,24.25 97.38,25.12 | SK6.1 98.25,41.25 98.25,51.5 97,52.75 93,52.75 92.75,52.5 v88.5,52.5 84.72,52.5 84.47,52.75 | 84.47,52.75 R28.2 84.01,51.28 v82.8,51.28 | 84.47,52.75 84.47,54.24 R30.2
  Bottom 0.813: C11.1 64.22,28.53 65.5,27.5 65.5,21.37 65,20.87
  Bottom 1.27: v31.75,19.25 26.5,19.25 v25.5,20.25 24.5,19.25 v9.5,19.25 8,20.75 8,41.25 8,41.75 6.48,43.27 JP2.2 JP2.4 | C12.1 65,20.87 65.23,20.87 C19.-
  other vias: 24.38,64.53 27.18,61.72 22,75 21,77 21,81 21,79 24,75 26,75 28,75 33.52,77.01 33.52,79.01 35,81 38,81 41,81 44,81 47,81 50,81 53,81 57,81 60,81 63,81 66,81 69,81 72,81 74,81 77,81 80,81 83,81 86.67,81.01 90,81 93,81 96,81 99,81 99,78.56 99,75 99,71 99,68 99,65 99,62 99,59 99,56 99,53 99,50 99,47 99,44 99,41 99,38 99,35 99,32 99,29 99,26 99,23 99,20 99,17 99,14 99,11 99,8 99,5 99,2 98,1 95,1 92,1 89,1 86,1 83,1 80,1 77,1 74,1 71,1 68,1 65,1 62,1 59,1 56,1 53,1 50,1 47,1 44,1 41,1 38,1 35,1 32,1 29,1 26,1 23,1 20,1 17,1 14,1 11,1 8,1 5,1 2,1 1,2 1,5 1,8 1,11 1,14 1,17 1,20 1,23 1,26 1,29 1,32 1,35 1,38 1,41 1,44 1,47 1,50 1,53 1,56 1,59 1,62 1,65 1,68 1,71 1,74 1,77 1,80 2,81 5,81 8,81 11,81 14,81 17,81 19,81 30,75 32,75 33.52,81.01 82,63 71.9,71.2 86,70 71,59 56,61 55.47,27 84.47,25 24.41,55.64 37.41,55.64 16.53,63.71 88.63,66.1 81.19,36.61 73,36 85,34 79.5,53 61.5,45.5 57.45,45.25 38.46,53.69 30.46,53.64 72.74,42.39
  pour Top (isolate 0.279): 0,82.5 100,82.5 100,0 0,0
  pour Bottom (isolate 0.279): 0,82.5 100,82.5 100,0 0,0
L1  (via drill 0.33 pad 0.41)
  Top 0.305: U1.16 80.88,28.37 v81.5,27.75 | v22.25,44.25 18.2,44.25 R17.2
  Bottom 0.305: v81.5,27.75 81.5,27.25 81,26.75 80.25,26.75 78.75,28.25 76.25,28.25 73.75,30.75 71,30.75 68.5,33.25 62,33.25 59.5,30.75 56.75,30.75 54.75,28.75 51.5,28.75 40.25,40 26.5,40 v22.25,44.25
L2  (via drill 0.33 pad 0.41)
  Top 0.305: R18.1 11.57,45.32 12.25,46 19.75,46 v20.5,45.25 | v81.75,29.75 81.75,29.82 U1.17
  Bottom 0.305: v20.5,45.25 20.5,44.75 22.25,43 22.75,43 26.5,39.25 40.25,39.25 51.25,28.25 55,28.25 57,30.25 59.75,30.25 62.25,32.75 68.25,32.75 70.75,30.25 73.5,30.25 76,27.75 78.5,27.75 80,26.25 81.25,26.25 82.5,27.5 82.5,28.75 v81.75,29.75
LIGHT  (via drill 0.37 pad 0.41)
  Top 0.305: 77,27.25 v77.25,27 76.88,27.37 U1.8
  Bottom 0.305: v77.25,27 76.5,26.25 76.5,6.3 77.7,5.1 SK3.2
LOCK_CLOSE  (via drill 0.33 pad 0.38)
  Top 0.305: U1.56 77.26,34.49 79,32.75 v79,32.5
  Bottom 0.305: v79,32.5 79.5,32 85.5,32 86.25,32.75 86.25,50.7 R28.1
  Bottom 0.406: R27.2 R28.1
LOCK_OPEN  (via drill 0.33 pad 0.38)
  Top 0.305: U1.57 76.76,33.99 v77.75,33
  Bottom 0.305: v77.75,33 78.25,33 78.5,33.25 79.5,33.25 80.25,32.5 85.25,32.5 85.75,33 85.75,42 81.75,46 81.75,54.5 83,55.75 86,55.75 86.25,55.5 86.25,54.36 R30.1
  Bottom 0.406: R29.2 R30.1
M1
  Top 0.305: U1.20 87.76,31.99 93.75,26 93.75,19.5 95.5,17.75 SK2.2
M2
  Top 0.305: U1.21 88.01,32.49 94.25,26.25 94.25,21 95,20.25 96.25,20.25 SK2.3
MAIN_POW  (via drill 0.33 pad 0.41)
  Top 0.305: D2.A 45.5,38 v47.25,36.25 | v76.5,30.5 76.5,30.2 77.38,29.32 U1.9
  Bottom 0.305: v47.25,36.25 47.25,35.25 52.25,30.25 54,30.25 56,32.25 58.75,32.25 61.25,34.75 69.25,34.75 71.75,32.25 75,32.25 76.5,30.75 v76.5,30.5
MIR_POW  (via drill 0.33 pad 0.41)
  Top 0.305: U1.11 78.38,29.88 v78.5,30
  Bottom 0.305: v78.5,30 78.5,30.25 75.5,33.25 72.25,33.25 69.75,35.75 60.25,35.75 57.25,38.75 55.81,38.75 R33.1
MIR_POW_B  (via drill 0.33 pad 0.38)
  Top 0.305: v38.5,49.75 39.44,49.75 D4.A
  Top 0.406: Q21.C 43.07,46.11 D4.A
  Bottom 0.305: JP2.13 14.67,62.08 21.5,55.25 21.5,52.25 23.5,50.25 35.75,50.25 36.5,49.5 38.25,49.5 v38.5,49.75
N$1
  Bottom 0.61: R9.2 68.13,10.57 Q5.1
N$2
  Bottom 0.61: Q5.3 69.1,3.35 SK1.3
N$3
  Bottom 0.406: X7.1 91.28,51.02 R27.1
N$4  (via drill 0.5 pad 0.61)
  Top 0.406: X6.2 10.26,39.75 Q15.C 11.11,39.36 v9.75,38 | v19.5,37.5 20.51,37.5 Q14.C
  Bottom 0.406: v9.75,38 10,38 11.75,36.25 18.25,36.25 v19.5,37.5
N$5  (via drill 0.5 pad 0.61)
  Top 0.406: X6.1 10.87,36.25 Q11.C 11.25,36.15 v11.25,34.5 | Q10.C 17.73,41.73 v17.75,41.75
  Bottom 0.406: v17.75,41.75 17.75,41.25 21,38 21,36.75 19,34.75 11.5,34.75 v11.25,34.5
N$6
  Bottom 0.406: X7.2 91.2,54.52 R29.1
N$7
  Top 0.406: Q12.C 19.55,40.3 Q10.B
N$8
  Top 0.406: Q13.C 18.55,36.31 Q14.B
N$9
  Top 0.406: Q11.B 16.04,35.34 Q13.E
N$10
  Top 0.61: D1.C 33.29,38.25 R1.2
N$11
  Bottom 0.305: R8.2 55.55,35.27 SP1.+
N$12
  Bottom 0.406: Q6.C 84.5,13.05 R11.1 Q7.1
N$13
  Top 0.305: Q8.1 58.55,56.05 59.5,57 62.17,57 R12.2
N$14
  Top 1.27: IC2.1 21.01,20.46 R6.2 R7.1
N$15
  Bottom 0.406: Q6.B 86.37,8.4 R10.2
N$16  (via drill 0.33 pad 0.38)
  Top 0.305: 23,57 v23.25,56.75 22.79,57.21 BT1.19
  Bottom 0.305: D3.C v23.25,56.75
N$17  (via drill 0.33 pad 0.38)
  Top 0.305: v37.5,43 37.61,43 Q22.B
  Bottom 0.305: R34.2 51.85,42.65 49.75,44.75 42.5,44.75 42,44.25 38.75,44.25 v37.5,43
N$18
  Top 0.406: Q8.3 58.1,58.1 57.25,57.25 57.25,54.75 57,54.5 20.25,54.5 19.75,55 19.75,59.46 BT1.17 | BT1.17 18.07,59.93 17.5,60.5 17.5,75 18.5,76 20.27,76 BT1.1 | BT1.17 21.68,59.93 27.75,66 35.17,66 BT1.37
N$19
  Top 0.305: BT1.35 37.68,63.93 39,65.25 39,66.69 JP4.1
N$20
  Bottom 0.61: SK4.1 59.25,5.56 R31.1
N$21
  Top 0.406: SK6.2 96.75,45.85 Q9.3
N$22
  Bottom 0.305: R24.1 74.13,64.59 K2.1
N$23
  Top 0.406: Q12.B 16.08,44.03 R17.1
N$24
  Bottom 0.61: SK4.2 62.3,3 64.05,4.75 64.05,6.47 Q20.B
N$25  (via drill 0.5 pad 0.81)
  Top 0.406: Q13.B 15.74,37.26 v14.75,38.25 | v14.75,42.5 14.75,42.84 R18.2
  Bottom 0.406: v14.75,38.25 v14.75,42.5
N$26
  Top 0.406: Q15.B Q12.E
N$27
  Top 0.305: R16.2 94.07,46.62 Q9.1
N$28  (via drill 0.33 pad 0.38)
  Top 0.305: v35.56,42.75 36,42.77 36.5,42.25 38.5,42.25 39,42.75 41.37,42.75 Q21.B
  Bottom 0.305: R33.2 54.27,42.73 51.75,45.25 37.96,45.25 v35.56,42.75
N$29
  Top 0.305: JP4.2 41.48,63.73 40.5,62.75 35.42,62.75 BT1.34
N$30
  Bottom 0.305: K2.10 73.45,68.19 72.23,69.41 R25.1
N$31  (via drill 0.33 pad 0.38)
  Top 0.305: v80.75,54.75 82.33,54.75 Q18.C
  Bottom 0.305: K2.5 84.29,58.29 v80.75,54.75
N$32  (via drill 0.33 pad 0.38)
  Top 0.305: Q19.C 86.18,54.93 v87,56
  Bottom 0.305: K2.6 84.29,63.21 87,60.5 v87,56
N$33
  Top 0.305: Q18.B 81.47,50.53 82.25,49.75 83.54,49.75 R23.2
N$34
  Bottom 0.305: K1.1 R20.1
N$35  (via drill 0.33 pad 0.38, 0.4 pad 0.2)
  Top 0.305: v62,73.75 62.5,74.25 62.47,74.28 v62.47,76.86
  Bottom 0.305: 62.17,69.58 R21.1 61,70.86 61,72.75 v62,73.75 | K1.10 v62.47,76.86
N$36  (via drill 0.33 pad 0.38)
  Top 0.305: Q16.C 64.92,68.58 v65,68.5
  Bottom 0.305: v65,68.5 66.23,68.5 K1.5
N$37  (via drill 0.33 pad 0.38)
  Top 0.305: Q17.C 59.84,68.59 61.5,70.25 62.75,70.25 63.5,71 63.5,77.5 v63.75,77.75
  Bottom 0.305: v63.75,77.75 67.86,77.75 K1.6
N$38
  Top 0.305: Q16.B 61.9,64.69 R19.2
N$39
  Top 0.305: JP4.3 44.02,63.52 42.5,62 35.31,62 BT1.33
N$40
  Top 1.27: R5.1 28.33,27.1 Q2.4 28.83,26.9 R4.1
N$41
  Top 0.305: R22.1 61.05,61.45 58,64.5 58,66.35 Q17.B
N$42
  Top 0.305: BT1.32 37.68,60.93 38.25,61.5 43.75,61.5 46.5,64.25 46.5,66.69 JP4.4
N$43
  Top 0.61: R1.1 35.97,36.69 R2.1 36.03,33.95 Q1.B
N$44
  Top 0.61: Q2.1 31,34.76 31,33.25 32.89,31.36 Q1.C 36.92,31.36 R3.1
N$45
  Top 0.61: R2.2 39.02,38.53 D2.C
N$46
  Top 1.27: C1.+ 41.29,26.1 R4.2 39.61,26.02 IC1.3 39.04,21.03 C3.1
N$47
  Top 0.406: BT1.49 37.6,77.93 C22.+
N$48
  Top 0.406: BT1.46 37.09,74.93 C23.+
N$49
  Top 1.27: IC2.3 12.91,24.89 | 12.91,24.89 C2.+ | 12.91,24.89 15.12,27.1 R5.2 17.4,27.1 21,23.5 24.75,23.5 25.75,22.5 26.5,22.5 27.75,21.25 27.75,19.44 C4.1
N$50
  Top 0.305: R26.1 86.37,50.38 85.25,51.5 85.25,52.62 Q19.B
N$51
  Top 0.406: C22.- 48.51,78 C24.2 50.96,78.04 L1.1
N$52
  Top 0.406: C23.- 48.34,73.1 C25.1 50.85,72.99 L2.1
N$53
  Top 0.305: SJ5.2 R13.1
N$54
  Top 0.406: K1.7 67.31,79.69 69.25,77.75 72.5,77.75 73.5,76.75 73.5,74.36 J2.3
N$55  (via drill 0.33 pad 0.38)
  Top 0.305: v61.5,43.75 61.5,42.75 61.25,42.5 59.96,42.5 Q28.B
  Bottom 0.305: R40.2 63.78,42.47 62.5,43.75 v61.5,43.75
N$56
  Top 0.406: K1.4 67.26,72.26 69,74 70.5,74 74,70.5 83.36,70.5 J2.2
N$57
  Top 0.406: K2.3 79.21,60.29 80.75,58.75 89,58.75 J1.2
N$58
  Top 0.406: K2.8 79.21,68.04 81,66.25 87,66.25 J1.3
N$59  (via drill 0.33 pad 0.41)
  Top 0.305: v33.18,42.2 33.3,42.2 34,41.5 38.5,41.5 39.25,42.25 44.87,42.25 Q23.B
  Bottom 0.305: R35.2 56.67,42.83 53.75,45.75 36.75,45.75 v33.18,42.2
N$60
  Bottom 0.61: U2.NET 90.03,15.22 93.5,11.75 X3.1
N$61  (via drill 0.33 pad 0.41)
  Top 0.305: v26.5,42.25 26.5,43.88 Q24.B
  Bottom 0.305: R36.2 40.48,42.23 39.25,41 27.75,41 v26.5,42.25
N$63  (via drill 0.33 pad 0.38)
  Top 0.305: v32.25,42.25 32.25,42 33.25,41 39,41 39.75,41.75 48.37,41.75 Q25.B
  Bottom 0.305: R37.2 59.02,42.48 55.25,46.25 36.25,46.25 v32.25,42.25
N$64
  Bottom 0.305: R49.1 56.05,66.3 Q33.B
N$66
  Bottom 0.305: R51.1 54.85,62.75 Q32.B
N$68  (via drill 0.33 pad 0.41)
  Top 0.305: Q26.B 66.53,43.47 67.75,42.25 69,42.25 v70.25,43.5
  Bottom 0.305: v70.25,43.5 69.87,43.5 R38.2
N$70  (via drill 0.33 pad 0.38)
  Top 0.305: v31.42,42.48 31.45,41.77 32.75,40.5 39.5,40.5 40.25,41.25 51.86,41.25 Q29.B
  Bottom 0.305: R41.2 61.44,42.31 57,46.75 35.75,46.75 v31.42,42.48
N$72  (via drill 0.33 pad 0.41)
  Top 0.305: Q27.B 62.55,43.7 64,42.25 65,42.25 65.5,42.75 v65.5,43.75
  Bottom 0.305: v65.5,43.75 65.5,42.89 R39.2
N$75  (via drill 0.33 pad 0.38)
  Top 0.305: v34.5,42.25 34.5,43.87 Q30.B
  Bottom 0.305: R42.2 49.49,42.76 48,44.25 43,44.25 42.5,43.75 40.5,43.75 38.75,42 34.75,42 v34.5,42.25
N$77  (via drill 0.33 pad 0.41)
  Top 0.305: v30.5,42 30.5,43.87 Q31.B
  Bottom 0.305: R43.2 47.14,42.61 46,43.75 43.5,43.75 42.75,43 40.5,43 39,41.5 30.75,41.5 v30.5,42
N$91
  Top 0.406: K2.2 76.67,60.08 79.25,57.5 87.75,57.5 88.75,56.5 90.5,56.5 91.5,58 91.5,66 92.5,67 92.5,69.25 95.5,72.25 98.04,72.25 J3.2
N$92
  Top 0.406: K2.9 77.06,68.19 80.5,64.75 88.75,64.75 91.5,67.5 91.5,68.93 J3.3
N$93
  Top 0.406: K1.8 64.72,74.28 66,73 66,71 67.5,69.75 80.19,69.75 K2.7
N$94
  Top 0.406: K1.3 64.72,71.03 70,66.25 76.07,66.25 K2.4
NRST  (via drill 0.33 pad 0.38, 0.33 pad 0.41, 0.37 pad 0.41)
  Top 0.305: U1.7 76.38,26.37 76.75,26 v77.5,26 | 80.5,10.3 S1.A2 | 81.5,9.25 S1.A2 | v54.75,16.75 54.75,8.25 56.25,6.75 71.75,6.75 74.2,4.3 74.2,2.7 74.9,2 78.2,2 78.7,2.5 78.7,4.1 81.78,7.18 S1.A2 | SJ5.1 12.51,61.99 11.25,63.25 11.25,67.9 10.75,68.4 v5.3,68.4
  Top 0.406: S1.A2 83.46,9.02 C20.2 | 80.5,10.3 77.94,10.3 v77.5,10.75
  Bottom 0.305: v77.5,26 v77.5,10.75 | v54.75,16.75 54.75,17.25 52.5,19.5 52.5,26.25 40,38.75 26.25,38.75 22.5,42.5 22,42.5 17.5,47 17.5,52 17,52.5 16,52.5 14.25,50.75 5.75,50.75 5,51.5 5,68.1 v5.3,68.4
OSC_IN
  Top 0.305: U1.5 75.38,24.93 Q3.2 72.8,19.36 C10.2
OSC_OUT
  Top 0.305: U1.6 75.88,25.12 76,25 79.81,25 Q3.1 81.07,20.96 C9.2
PELTIER  (via drill 0.33 pad 0.38)
  Top 0.305: U1.37 78.88,42.12 v78.75,42.25 | v68.8,48 68.8,48.25 68,49 68,52.5 67.5,53 67.5,53.9 v67.4,54
  Bottom 0.305: v78.75,42.25 78.5,42.5 75.5,42.5 72.25,45.75 69.5,45.75 68.75,46.5 68.75,47.75 68.8,47.8 v68.8,48 | v67.4,54 67.4,55.6 60.25,62.75 R51.2
PELTIER_B  (via drill 0.33 pad 0.38)
  Top 0.305: v29,67.5 25.75,67.5 v24.5,66.25
  Bottom 0.305: Q32.C 49.55,65.85 R50.1 49.5,65.75 47.75,64 32.25,64 29,67.25 v29,67.5 | v24.5,66.25 24,66.25 23.25,65.5 17.25,65.5 15.61,67.14 JP2.17
RFID_CS  (via drill 0.37 pad 0.41)
  Top 0.305: U1.33 93.81,39.94 v94,39.75
  Bottom 0.305: v94,39.75 94,38.25 SK5.5
RFID_INT  (via drill 0.37 pad 0.41)
  Top 0.305: U1.45 74.88,42.38 77,44.5 86.5,44.5 86.75,44.75 v88.5,44.75
  Bottom 0.305: SK5.1 96,27.5 94.25,29.25 94.25,35 91.25,38 91.25,42 v88.5,44.75
RFID_MISO  (via drill 0.37 pad 0.41)
  Top 0.305: U1.35 79.88,41.13 80.25,41.5 82.25,41.5 82.75,41 92.5,41 v93,41.25
  Bottom 0.305: v93,41.25 93,38.25 95.75,35.5 95.75,33 96.25,32.5 97.5,32.5 97.75,32.25 97.75,30.5 SK5.2
RFID_MOSI  (via drill 0.37 pad 0.41)
  Top 0.305: U1.36 79.38,41.38 80,42 82.5,42 83,41.5 91.25,41.5 92,42 v92.25,42
  Bottom 0.305: v92.25,42 92.25,41.75 92,41.5 92,38.25 95,35.25 95,32 95.5,31.5 SK5.3
RFID_POW  (via drill 0.33 pad 0.38)
  Top 0.305: U1.50 71.25,37.5 69.5,37.5 71.4,39.4 71.4,49.35 70.5,50.25 v70.5,52.25 70.65,52.1 | R16.1 89.5,46.89 89.5,54.5 87.5,56.75 v81,56.75
  Bottom 0.305: v70.5,52.25 76.5,52.25 v81,56.75
RFID_SCK  (via drill 0.37 pad 0.41)
  Top 0.305: U1.34 80.38,40.88 80.5,41 82,41 82.5,40.5 93.5,40.5 v94,41
  Bottom 0.305: v94,41 94.25,41 95.25,40 95.25,38.75 97.75,36.25 97.75,34.5 SK5.4
SIM_POW  (via drill 0.33 pad 0.41)
  Top 0.305: U1.58 76.26,33.49 v76.75,33 | v85.5,19 85.5,16.75 85.75,16.5 85.75,14 86.5,13.25 v87.25,13.25
  Bottom 0.305: v76.75,33 78.25,31.5 84,31.5 85.75,29.75 85.75,19.25 v85.5,19 | v87.25,13.25 87.25,11.74 R10.1
SIM_RS  (via drill 0.37 pad 0.41)
  Top 0.305: v89.75,42.5 83.25,42.5 82.75,43 77.75,43 76.88,42.13 U1.41
  Bottom 0.305: U2.RST 89.05,20.3 90.5,21.75 90.5,41.75 v89.75,42.5
SIM_RX  (via drill 0.37 pad 0.41)
  Top 0.305: v88.75,43.25 83.25,43.25 83,43.5 77.5,43.5 76.38,42.38 U1.42
  Bottom 0.305: U2.RXD 88.09,22.84 89.75,24.5 89.75,41 88.75,42 v88.75,43.25
SIM_TX  (via drill 0.37 pad 0.41)
  Top 0.305: U1.43 75.88,42.63 77.25,44 v88,44
  Bottom 0.305: U2.TXD 87.88,25.38 89,26.5 89,40.75 88,41.75 v88,44
SWCLK
  Top 0.305: U1.49 72,38.56 72,47.02 JP1.3
SWDIO  (via drill 0.33 pad 0.38)
  Top 0.305: U1.46 74.38,42.63 75.75,44 v75.75,44.25
  Bottom 0.305: v75.75,44.25 75.75,47.17 JP1.2
V+
  Top 0.305: R46.2 12.55,52.55 12.75,52.75 10.73,52.75 JP2.7
V+_2
  Top 0.305: R44.2 10.99,49.95 JP2.5
VCC  (via drill 0.5 pad 0.41)
  Top 0.305: IC2.2 16.5,10.09 16.5,10.2
  Top 0.406: 20.56,14.25 16.5,10.2 H2.1
  Top 0.61: v78.5,8.75 77,8.75 75.25,10.5 56.25,10.5 v55.75,10 | v28.25,14.25 20.56,14.25
  Top 1.27: C8.+ 5.9,25.15 3,22.25 3,16.25 6,13.25 11.1,13.25 H2.1 | R7.2 23.45,17.03 23.24,16.82 | 23.24,16.82 IC2.2 | C6.1 23.24,16.82
  Bottom 0.61: Q7.2 R11.2 81,13.25 79.75,12 79.75,10 v78.5,8.75 | v55.75,10 32.5,10 v28.25,14.25
WATER  (via drill 0.33 pad 0.41)
  Top 0.305: U1.55 63.74,34.99 59.5,30.75 59,30.75 v57.75,29.5
  Bottom 0.305: R32.1 61.15,17.85 59.25,19.75 59.25,26.75 57.75,28.25 v57.75,29.5
  Bottom 0.61: Q20.C 62.29,8.73 R32.1

## Text on the board
tNames: MO | MI | SCL | CS | P10 | P8 | P6 | P4 | P2 | P0 | A0 | Lock | GND | CLK | DO | 3V3 | Mirrors | RFID | Motion | GSM-ANT | Water | CAN | Light